# Altium schematic sheet LEDBAKL_TPS61040DBV.SchDoc
size A3
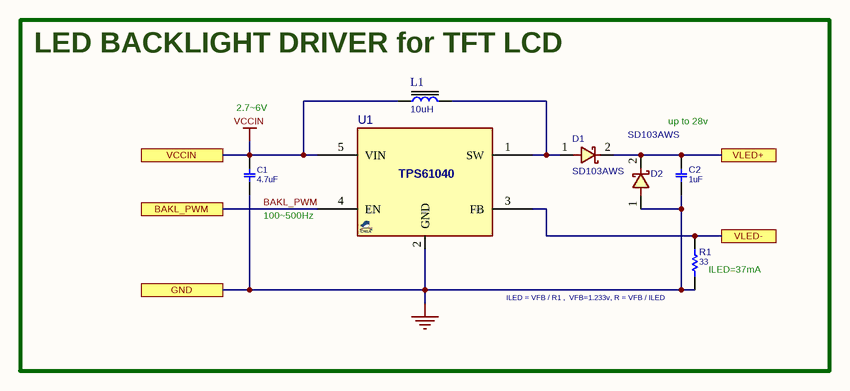
[diagram p0: LEDBAKL_TPS61040DBV.SchDoc]

## Parts
C1  4.7uF  [C0402]
C2  1uF  [C0603]
D1  SD103AWS  [D_SOD323]
D2  SD103AWS  [D_SOD323]
L1  10uH  [L_4]
R1  33  [R0402]
U1  TPS61040  [SOT23_5]  (value not drawn)

## Ports
BAKL_PWM, GND, VCCIN, VLED+, VLED-

## Nets
GND: C1.1 C2.1 D2.1 R1.2 U1.2(GND) ; port GND
VCCIN: C1.2 L1.1 U1.5(VIN) ; port VCCIN
BAKL_PWM: U1.4(EN) ; port BAKL_PWM
VLED+: C2.2 D1.2 D2.2 ; port VLED+
VLED-: R1.1 U1.3(FB) ; port VLED-
NetD1_1: D1.1 L1.2 U1.1(SW)

## Notes on the sheet
- (near L1) LED BACKLIGHT DRIVER for TFT LCD
- 2.7~6V
- up to 28v
- 100~500Hz
- (near R1) ILED = VFB / R1 ,  VFB=1.233v, R = VFB / ILED
- (near R1) ILED=37mA

## Library data of the parts
C1 = CAP_SMD_MLCC: CAP, MLCC; PARAM: X5R, 10%; MANF_P#: CL05A475MP5NRNC; MANF: Samsung; PARAM2: 10v; PRICE: 10,000:	$0.013; ASSEMBLY: ASSEMBLY; VALUE: 4.7uF
C2 = CAP_SMD_MLCC: CAP, MLCC; PARAM: X5R, 10%; MANF_P#: CL10A105KB8NNNC; MANF: Samsung; PARAM2: 50v; PRICE: 50,000:	$0.006; ASSEMBLY: ASSEMBLY; VALUE: 1uF
D1 D2 = DIODE_SMD_SCHOTTKY_1N5819: DIODE, SCHOTTKY, 40V, 2A; MANF: DIODES; DESC: DESCRIPTION; MANF_P#: SD103AWS; ASSEMBLY: ASSEMBLY; PRICE: PRICE; PARAM2: 2A; PARAM: 40V; VALUE: SD103AWS
L1 = INDPWR_SMD: INDUCTOR, POWER, SMD; MANF_P#: GCD43-100MC; VALUE: 10uH
R1 = RES_SMD: RESISTOR, SMD, 20K, 0402; MANF: Yageo; PARAM: 0.063W; DIST#: MOUSER; PARAM2: 1%; MANF_P#: RK73H1ETTP2002F; ASSEMBLY: ASSEMBLY; PRICE: 100= 0.5$; DESC: RESISTOR, SMD, 20K, 0402; VALUE: 33
U1 = VREG_TPS61040_SOT23: REG, Switching, Boost, 0.4A, ADJ, 1MHz, SOT-23-5; PARAM2: 1MHz, 1.8~6VIN; MANF_P#: TPS61040DBVR; MANF: TI; PARAM: 0.4A, ADJ; VALUE: TPS61040